# Altium project PCB_Project5.PrjPCB
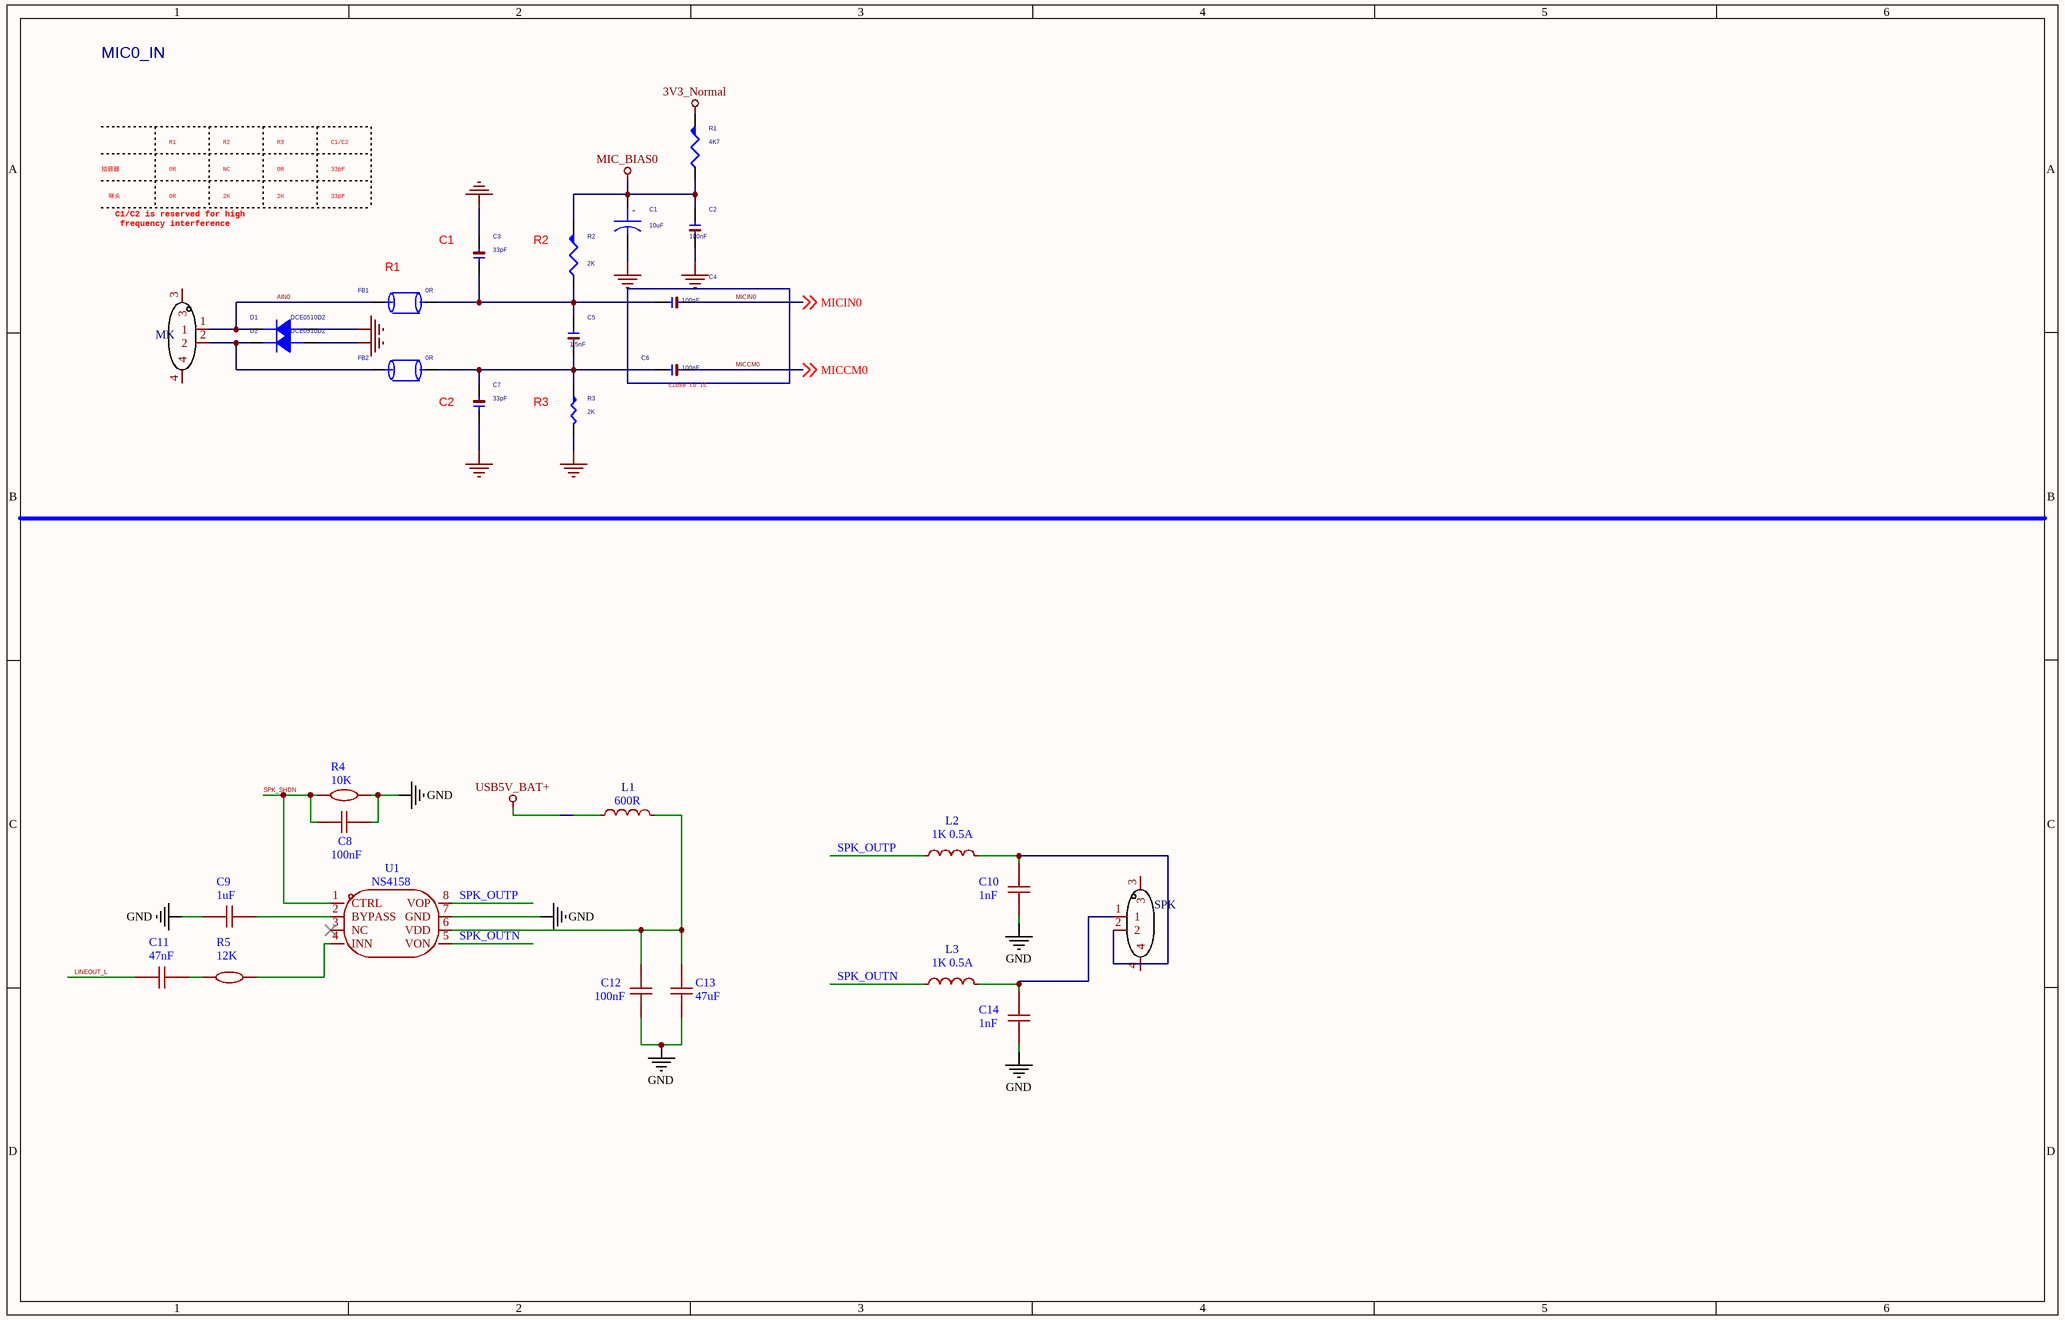
[diagram p0: AUDIO.SchDoc]
5 sheets, 256 parts. Net scope: global (net labels, ports and power ports of the same name join across sheets).
Board file: PCB1.PcbDoc
Sheets:
  AUDIO.SchDoc
  Bluetooth.SchDoc
  POWER.SchDoc
  QFN88_FLASH_UART.SchDoc
  USB_CHARGE.SchDoc

## Sheet AUDIO.SchDoc
size 386 x 246 mm

### Parts
C1  10uF  [C0603]
C2  100nF  [C0402]
C3  33pF  [C0402]
C4  100nF  [C0402]
C5  1.5nF  [C0402]
C6  100nF  [C0402]
C7  33pF  [C0402]
C8  100nF  [C0402]
C9  1uF  [C0805]
C10  1nF  [C0805]
C11  47nF  [C0805]
C12  100nF  [C0805]
C13  47uF  [C1206]
C14  1nF  [C0805]
CON1  MK  [CONN-SMD_2P-P1.25-LT]
CON2  SPK  [CONN-SMD_2.0-2PLT]
D1  DCE0510D2  [D0402_0.55x0.6]
D2  DCE0510D2  [D0402_0.55x0.6]
FB1  0R  [R0402]
FB2  0R  [R0402]
L1  600R  [L1206]
L2  1K 0.5A  [L0805]
L3  1K 0.5A  [L0805]
R1  4K7  [R0402]
R2  2K  [R0402]
R3  2K  [R0402]
R4  10K  [R0402]
R5  12K  [R0402]
U1  NS4158  [SOIC-8_L4.9-W3.9-P1.27-LS6.0-BL]

### Nets
3V3_Normal: R1.1
GND: C1.2 C2.2 C3.1 C7.2 C8.2 C9.1 C10.1 C12.1 C13.1 C14.1 D1.1(A) D2.1(A) R3.2 R4.2 U1.7(GND)  [project net DGND]
MIC_BIAS0: C1.1 C2.1 R1.2 R2.1
USB5V_BAT+: L1.1
AIN0: CON1.1 D1.2(K) FB1.1
LINEOUT_L: C11.1
MICCM0: C6.2 ; off-sheet MICCM0
MICIN0: C4.2 ; off-sheet MICIN0
SPK_OUTN: L3.1 U1.5(VON)
SPK_OUTP: L2.1 U1.8(VOP)
SPK_SHDN: C8.1 R4.1 U1.1(CTRL)
NetC3_2: C3.2 C4.1 C5.1 FB1.2 R2.2
NetC5_2: C5.2 C6.1 C7.1 FB2.2 R3.1
NetC9_2: C9.2 U1.2(BYPASS)
NetC10_2: C10.2 CON2.2 L2.2
NetC11_2: C11.2 R5.1
NetC12_2: C12.2 C13.2 L1.2 U1.6(VDD)
NetC14_2: C14.2 CON2.1 L3.2
NetCON1_2: CON1.2 D2.2(K) FB2.1
NetR5_2: R5.2 U1.4(INN)

Not connected (* = marked no-connect by the designer): CON1 3 4; CON2 3 4; U1 3(NC)*

### Notes on the sheet
- MIC0_IN
- 拾音器
- 0R
- R1
- NC
- R2
- R3
- 33pF
- C1/C2
- 咪头
- C1/C2 is reserved for high
  frequency interference
- 2K
- (near C3) C1
- (near R2) R2
- (near FB1) R1
- (near C6) close to IC
- C2
- (near R3) R3
- (in symbol CAP POL) +

### Library data of the parts
C1 = CAP POL
C2 C4-C6 = C0805_10uF: Class: DISCRETE
C3 C7 = C0402: Class: DISCRETE
C8-C12 C14 = CAP_0805: Symbol: CapAcitance; Convert to PCB: yes; Device: CAP_0805; Add into BOM: yes; Supplier Footprint: 0805
  C8 C12: Value: 100nF
  C9: Value: 1uF
  C10 C14: Value: 1nF
  C11: Value: 47nF
C13 = CAP_1206: Symbol: CapAcitance; Convert to PCB: yes; Device: CAP_1206; Add into BOM: yes; Supplier Footprint: 1206; Value: 47uF
CON1 CON2 = HC-1.25-2PLT: Add into BOM: yes; Pins Structure: 1x2P; Pitch: 1.25mm; Number of PINs Per Row: 2; Current Rating (Max): 2A; Symbol: HC-1.25-2PLT; Device: HC-1.25-2PLT; Supplier Part: C2845388; Manufacturer Part: HC-1.25-2PLT; Supplier Footprint: SMD,P=1.25mm; JLCPCB Part Class: Extended Part; Datasheet: https://atta.szlcsc.com/upload/public/pdf/source/20230707/8E5913B5A3195C18F5EE12EA4CB86B82.pdf; Supplier: LCSC; Convert to PCB: yes; Reference Series: -; Number of Pins: 2P; Number of Rows: 1; Row Spacing: -
D1 D2 = DIODE_Dup1
FB1 FB2 = BEAD: BEAD/0402/120ohm/200MA; Part_Type: 0402贴片磁珠; Part_Number: 49223; CLASS: DISCRETE; Fanvil_Spec: 0402-600Ω&100M/100mA/FBMA-11-100505-601T; C5_Val: 120; C4_Unit: R; C3_Pkg: 0402; C1_Manu: SMT; Fanvil_Type: 磁珠; Fanvil_ID: INT.1013; C2_Type: BEAD
L1 = CBW321609U601T: Add into BOM: yes; Current Rating: 2A; Circuits: 1; Symbol: CBW321609U601T; Device: CBW321609U601T; Supplier: LCSC; Manufacturer Part: 600R; Supplier Part: C73732; Supplier Footprint: 1206; Datasheet: https://atta.szlcsc.com/upload/public/pdf/source/20190129/C361676_507080CDC8DBC2B0B7C2139C1873642D.pdf; Convert to PCB: yes
L2 L3 = SBK201209T-102Y-N: Add into BOM: yes; Current Rating: 200mA; Circuits: 1; Symbol: SBK201209T-102Y-N; Device: SBK201209T-102Y-N; Supplier Part: C142036; Supplier Footprint: 0805; Datasheet: https://atta.szlcsc.com/upload/public/pdf/source/20181119/C285644_F4950E68CEB7BD9E18B05382B5272067.pdf; Supplier: LCSC; Convert to PCB: yes
  L2: Manufacturer Part: SBK201209T-102Y-N
  L3: Manufacturer Part: 1K 0.5A
R1 R2 = R-PIN-Mark
R3 = R0402: Class: DISCRETE
R4 = Res_0805: Convert to PCB: yes; Device: Res_0805; Add into BOM: yes; Supplier Footprint: 0805; Value: 10K
R5 = Res_0805: Convert to PCB: yes; Value: 30K; Device: Res_0805; Add into BOM: yes; Supplier Footprint: 0805
U1 = NS4158: Add into BOM: yes; Symbol: NS4158; Device: NS4158; LCSC Part Name: NS4158; Supplier Part: C2890042; Manufacturer Part: NS4158; Supplier Footprint: SOIC-8; Datasheet: https://atta.szlcsc.com/upload/public/pdf/source/20210826/9C0306C24076E9EB95F6FF2952664B70.pdf; Supplier: LCSC; Convert to PCB: yes

## Sheet Bluetooth.SchDoc
size 386 x 246 mm
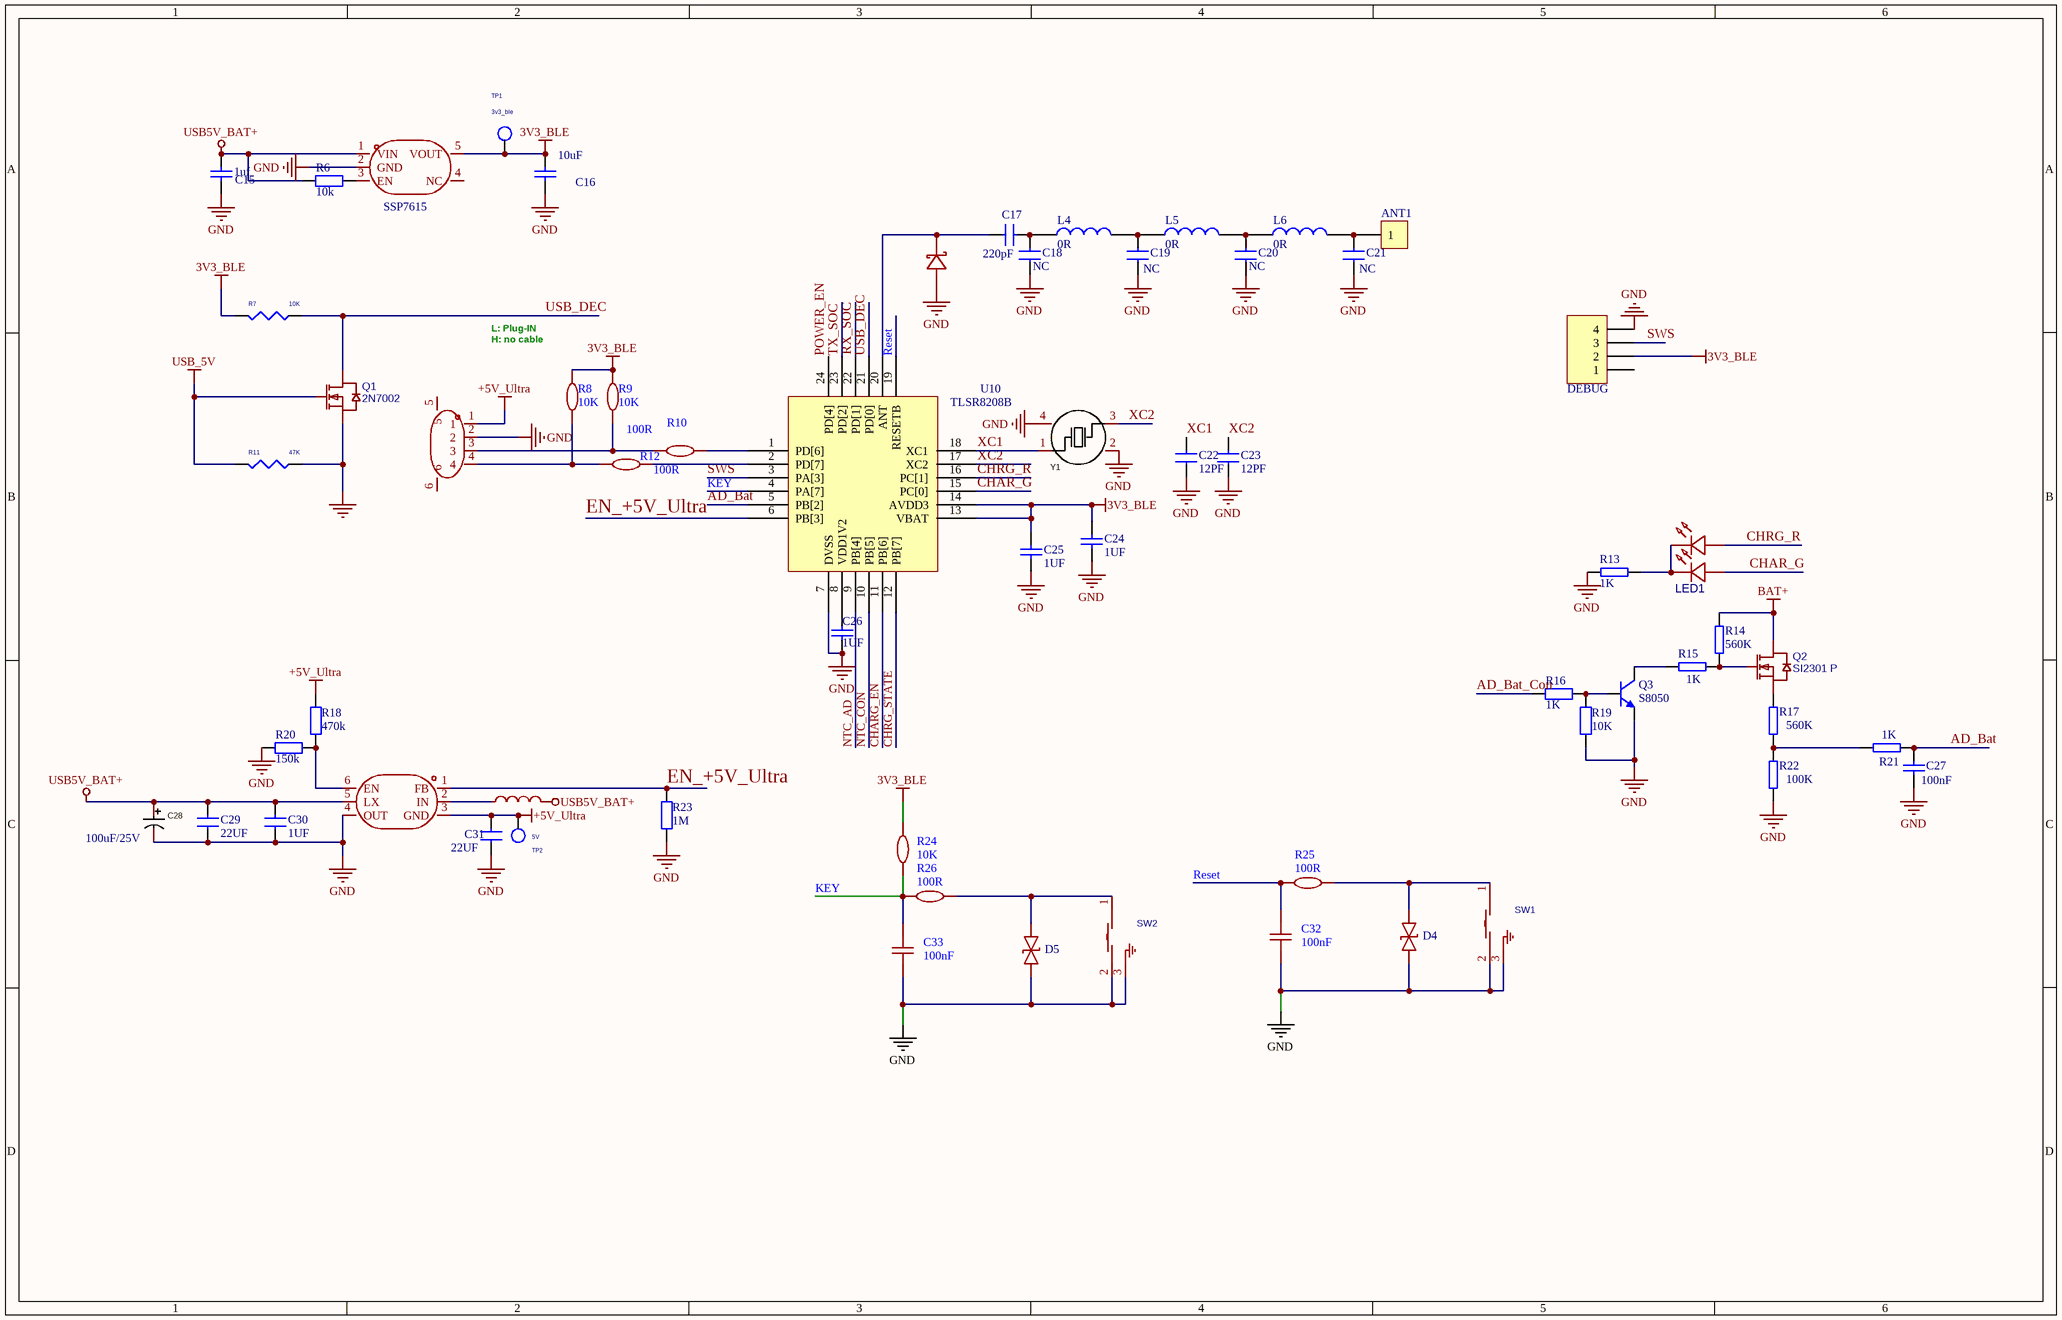
[diagram p1: Bluetooth.SchDoc]

### Parts
ANT1  (no value)  [tp]
C15  1uf  [0603_C]
C16  10uF  [0603_C]
C17  220pF  [0402_c]
C18  NC  [0402_C]
C19  NC  [0402_C]
C20  NC  [0402_C]
C21  NC  [0402_C]
C22  12PF  [0603_c]
C23  12PF  [0603_c]
C24  1UF  [0603_c]
C25  1UF  [0603_c]
C26  1UF  [0603_c]
C27  100nF  [c0402]
C28  100uF/25V  [SMD 6.3*5.4 电解]
C29  22UF  [0805_c]
C30  1UF  [0402_c]
C31  22UF  [0805_c]
C32  100nF  [c0402]
C33  100nF  [c0402]
CON4  Ultra  [CONN-SMD_4P-P1.25_LT]  (value not drawn)
D3  SE6V3LHN102T 6.3v单向  [0402-D]  (value not drawn)
D4  LESD5Z5.0CT1G  [SOD-523_L1.2-W0.8-LS1.6-BI]  (value not drawn)
D5  LESD5Z5.0CT1G  [SOD-523_L1.2-W0.8-LS1.6-BI]  (value not drawn)
L4  0R  [0402_R]
L5  0R  [0402_R]
L6  0R  [0402_R]
L7  SLW3012P1R5MST SMD3.0*3.0  [IND-SMD_L3.0-W3.0]  (value not drawn)
LED1  *  [LED-SMD_4P-L3.2-W1.6-TL_XL-3216SURUGC]  (value not drawn)
P1  DEBUG  [SIP4-2.54]
Q1  2N7002  [SOT-23]
Q2  SI2301 P  [SOT-23]
Q3  S8050  [SOT-23(SOT-23-3)]
R6  10k  [R0402]
R7  10K  [R0402]
R8  10K  [R0402]
R9  10K  [R0402]
R10  100R  [R0402]
R11  47K  [R0402]
R12  100R  [R0402]
R13  1K  [0603_R]
R14  560K  [R0402]
R15  1K  [R0402]
R16  1K  [R0402]
R17  560K  [R0402]
R18  470k  [0402_r]
R19  10K  [R0402]
R20  150k  [0402_r]
R21  1K  [R0402]
R22  100K  [R0402]
R23  1M  [0402_r]
R24  10K  [R0402]
R25  100R  [R0402]
R26  100R  [R0402]
SW1  Reset  [SMD-KEY-3]  (value not drawn)
SW2  OnOff  [SMD-KEY-3]  (value not drawn)
TP1  3v3_ble  [TP]
TP2  5V  [TP]
U2  SSP7615  [SOT-23-5]
U3  SY7069ADC  [SOT-23-6]  (value not drawn)
U10  TLSR8208B  [QFN-24-EP(4*4)]
Y1  24MHz +-20PPM  [CRYSTAL-SMD_4P-L3.2-W2.5]  (value not drawn)

### Nets
3V3_BLE: C16.2 C24.1 C25.1 P1.2 R7.1 R8.1 R9.1 R24.2 TP1.1(TP) U2.5(VOUT) U10.13(VBAT) U10.14(AVDD3)
+5V_Ultra: C31.2 CON4.1 R18.2 TP2.1(TP) U3.3(GND)
BAT+: Q2.2(D) R14.1
GND: C15.1 C16.1 C18.1 C19.1 C20.1 C21.1 C22.1 C23.1 C24.2 C25.2 C26.1 C27.1 C28.2 C29.1 C30.1 C31.1 C32.1 C33.1 CON4.2 D3.2(A) D4.1 D5.1 P1.4 Q1.2(S) Q3.2(E) R11.2 R13.1 R19.1 R20.2 R22.2 R23.1 SW1.2 SW1.3 SW2.2 SW2.3 U2.2(GND) U3.4(OUT) U10.7(DVSS) Y1.2(GND) Y1.4(GND)  [project net DGND]
USB5V_BAT+: C15.2 C28.1 C29.2 C30.2 L7.2 R6.1 U2.1(VIN) U3.5(LX)
USB_5V: Q1.1(G) R11.1
AD_Bat: C27.2 R21.1 U10.5(PB[2])
AD_Bat_Con: R16.2
CHAR_G: LED1.3(A) U10.15(PC[0])
CHARG_EN: U10.11(PB[6])
CHRG_R: LED1.1(A) U10.16(PC[1])
CHRG_STATE: U10.12(PB[7])
EN_+5V_Ultra: R23.2 U3.1(FB) U10.6(PB[3])
KEY: C33.2 R24.1 R26.2 U10.4(PA[7])
NTC_AD: U10.9(PB[4])
NTC_CON: U10.10(PB[5])
POWER_EN: U10.24(PD[4])
Reset: C32.2 R25.2 U10.19(RESETB)
RX_SOC: U10.22(PD[1])
SWS: P1.3 U10.3(PA[3])
TX_SOC: U10.23(PD[2])
USB_DEC: Q1.3(D) R7.2 U10.21(PD[0])
XC1: C22.2 U10.18(XC1) Y1.1(OSC1)
XC2: C23.2 U10.17(XC2) Y1.3(OSC2)
NetANT1_1: ANT1.1 C21.2 L6.2
NetC17_1: C17.1 D3.1(C) U10.20(ANT)
NetC17_2: C17.2 C18.2 L4.1
NetC19_2: C19.2 L4.2 L5.1
NetC20_2: C20.2 L5.2 L6.1
NetC26_2: C26.2 U10.8(VDD1V2)
NetCON4_3: CON4.3 R9.2 R10.2
NetCON4_4: CON4.4 R8.2 R12.2
NetD4_2: D4.2 R25.1 SW1.1
NetD5_2: D5.2 R26.1 SW2.1
NetL7_1: L7.1 U3.2(IN)
NetLED1_2: LED1.2(K) LED1.4(K) R13.2
NetQ2_1: Q2.1(G) R14.2 R15.1
NetQ2_3: Q2.3(S) R17.1
NetQ3_1: Q3.1(B) R16.1 R19.2
NetQ3_3: Q3.3(C) R15.2
NetR6_2: R6.2 U2.3(EN)
NetR10_1: R10.1 U10.1(PD[6])
NetR12_1: R12.1 U10.2(PD[7])
NetR17_2: R17.2 R21.2 R22.1
NetR18_1: R18.1 R20.1 U3.6(EN)

Not connected (* = marked no-connect by the designer): CON4 5 6; P1 1; U2 4(NC)

### Notes on the sheet
- L: Plug-IN
  H: no cable

### Library data of the parts
ANT1 = CON1: Connector
C15 = Cap1: 无极电容
C16 = Cap: Capacitor; Value: 10nF; Published: 8-Jun-2000; Revision: July-2002: Re-released for DXP Platform.; Publisher: Altium Limited
C17-C23 C29-C31 = CAP: Capacitor
C24-C27 = CAP
C28 = RVT1A221M0605_C72494: Symbol: RVT1A221M0605-C72494; Value: 220uF; Add into BOM: yes; Rated Voltage: 10V; Ripple Current: 90mA@120Hz; L: 5.4mm; Device: RVT1A221M0605_C72494; Supplier: LCSC; Manufacturer Part: RVT1A221M0605; Supplier Part: C72494; JLCPCB Part Class: Extended Part; Supplier Footprint: SMD,D6.3xL5.4mm; Datasheet: https://atta.szlcsc.com/upload/public/pdf/source/20170325/1490427950282.pdf; Convert to PCB: yes; Equivalent Series Resistance(ESR): -
C32 C33 = CAP_0603: Symbol: CapAcitance; Convert to PCB: yes; Device: CAP_0603; Add into BOM: yes; Supplier Footprint: 0603; Value: 100nF
CON4 = HC-1.25-4PLT: Symbol: HC-1.25-4PLT
D3 = TPNSR05F20NXT5G: Symbol: TPNSR05F20NXT5G
D4 D5 = LESD5Z5.0CT1G: Add into BOM: yes; Reverse Stand-Off Voltage (Vrwm): 5V; Maximum Clamping Voltage: 18.6V; Peak Pulse Current (Ipp)@10/1000us: 9.4A; Breakdown Voltage: 5.6V; Type: ESD; Symbol: LESD5Z5.0CT1G; Device: LESD5Z5.0CT1G; Supplier: LCSC; Manufacturer Part: LESD5Z5.0CT1G; Supplier Part: C136167; Supplier Footprint: SOD-523; Datasheet: https://atta.szlcsc.com/upload/public/pdf/source/20171026/C136167_15089841930291059137.pdf; Convert to PCB: yes
L4-L6 = INDUCTOR
L7 = SLW3012P1R5MST: Symbol: SLW3012P1R5MST
LED1 = TJ-S2012SW8TCGLC2R2G-A5: Symbol: TJ-S2012SW8TCGLC2R2G-A5
P1 = Header 4: Header, 4-Pin; LatestRevisionDate: 17-Jul-2002; LatestRevisionNote: Re-released for DXP Platform.; Publisher: Altium Limited
Q1 Q2 = JMTL3400A: Contributor: LCSC; BOM_Supplier: LCSC; BOM_Supplier Part: C2890442; BOM_Manufacturer Part: JMTL3400A; BOM_JLCPCB Part Class: Extended Part; spicePre: Q; spiceSymbolName: JMTL3400A
Q3 = NPN_sot23: NPN三极管
R6 R16 R18-R20 R23 = Res2: Resistor; Value: 120R; Published: 8-Jun-2000; LatestRevisionDate: 17-Jul-2002; LatestRevisionNote: Re-released for DXP Platform.; PackageReference: AXIAL-0.4; Publisher: Altium Limited
R7 R11 = R_Dup2
R8 R9 = Res_0603: Convert to PCB: yes; Value: 100R; Device: Res_0603; Add into BOM: yes; Supplier Footprint: 0603
R10 R12 R24-R26 = Res_0603: Convert to PCB: yes; Device: Res_0603; Add into BOM: yes; Supplier Footprint: 0603
  R10 R12 R25 R26: Value: 100R
  R24: Value: 10K
R13-R15 R17 R21 R22 = RES
SW1 SW2 = K2-1109SE-I4SW-04: Symbol: K2-1109SE-I4SW-04
TP1 TP2 = T POINT R
U2 = SSP7615-33M5R: Symbol: SSP7615-33M5R
Y1 = TAXM13.56M4RLBCCT2T: Name: 13.56MHz; Add into BOM: yes; Value: 13.56MHz; External load capacitor: 20pF; Device: TAXM13.56M4RLBCCT2T; Supplier Part: C164051; Manufacturer Part: TAXM13.56M4RLBCCT2T; Supplier Footprint: SMD3225-4P; JLCPCB Part Class: Extended Part; Datasheet: https://atta.szlcsc.com/upload/public/pdf/source/20171225/C164051_15141924799131203407.pdf; Supplier: LCSC; Convert to PCB: yes
U3 = SY7069ADC: Symbol: SY7069ADC

## Sheet POWER.SchDoc
size 513 x 304 mm
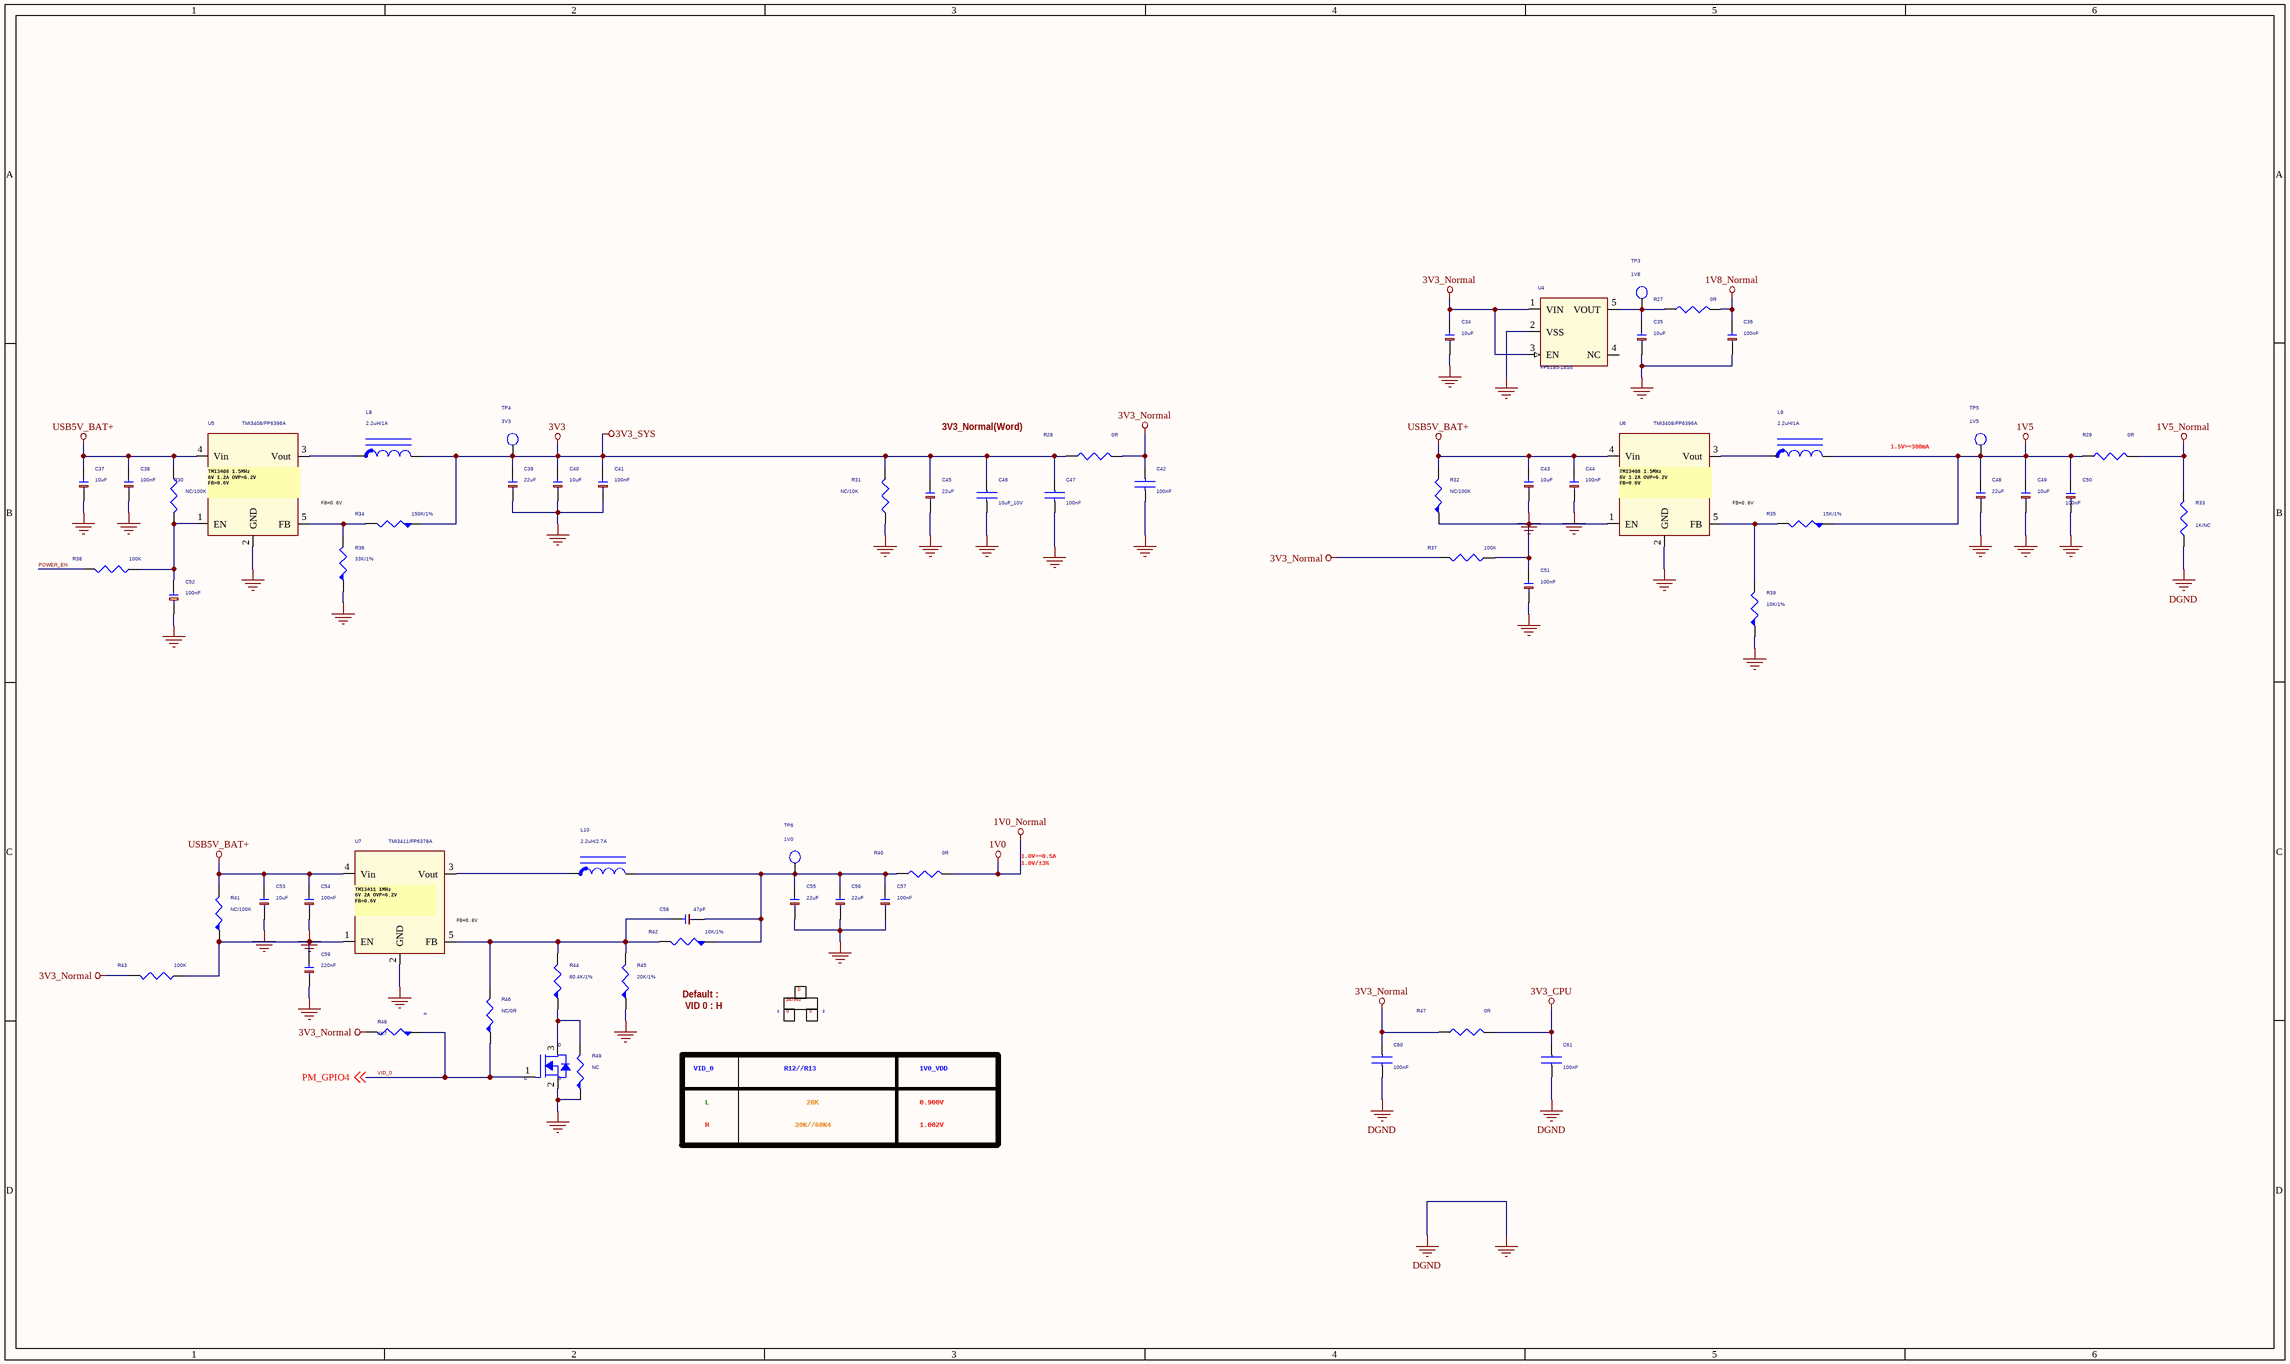
[diagram p2: POWER.SchDoc]

### Parts
C34  10uF  [C0402]
C35  10uF  [C0402]
C36  100nF  [C0402]
C37  10uF  [C0402]
C38  100nF  [C0402]
C39  22uF  [C0402]
C40  10uF  [C0402]
C41  100nF  [C0402]
C42  100nF  [C0402]
C43  10uF  [C0402]
C44  100nF  [C0402]
C45  22uF  [C0402]
C46  10uF_10V  [C0603]
C47  100nF  [C0402]
C48  22uF  [C0402]
C49  10uF  [C0402]
C50  100nF  [C0402]
C51  100nF  [C0402]
C52  100nF  [C0402]
C53  10uF  [C0402]
C54  100nF  [C0402]
C55  22uF  [C0402]
C56  22uF  [C0402]
C57  100nF  [C0402]
C58  47pF  [C0402]
C59  220nF  [C0402]
C60  100nF  [C0402]
C61  100nF  [C0402]
L8  2.2uH/1A  [SWPA3015S]
L9  2.2uH/1A  [SWPA3015S]
L10  2.2uH/2.7A  [L-MLPS-4018]
Q4  2N7002  [SOT-23]  (value not drawn)
R27  0R  [R0402]
R28  0R  [R1210]
R29  0R  [R1210]
R30  NC/100K  [R0402]
R31  NC/10K  [R0402]
R32  NC/100K  [R0402]
R33  1K/NC  [R0402]
R34  150K/1%  [R0402]
R35  15K/1%  [R0402]
R36  33K/1%  [R0402]
R37  100K  [R0402]
R38  100K  [R0402]
R39  10K/1%  [R0402]
R40  0R  [R1210]
R41  NC/100K  [R0402]
R42  10K/1%  [R0402]
R43  100K  [R0402]
R44  60.4K/1%  [R0402]
R45  20K/1%  [R0402]
R46  NC/0R  [R0402]
R47  0R  [R1210]
R48  4K7  [R0402]
R49  NC  [R0402]
TP3  1V8  [TP]
TP4  3V3  [TP]
TP5  1V5  [TP]
TP6  1V0  [TP]
U4  FP6185-18S5  [SOT23-5P]
U5  TMI3408/FP6396A  [SOT-23-5]
U6  TMI3408/FP6396A  [SOT-23-5]
U7  TMI3411/FP6378A  [SOT-23-5]

### Nets
1V0: R40.2  [also labelled 1V0_Normal]
1V5: C48.2 C49.2 C50.1 L9.2 R29.1 R35.1 TP5.1(TP)
1V5_Normal: R29.2 R33.1
1V8_Normal: C36.2 R27.2
3V3: C39.2 C40.2 C41.2 C45.2 C46.1 C47.1 L8.2 R28.1 R31.1 R34.1 TP4.1(TP)  [also labelled 3V3_SYS]
3V3_CPU: C61.1 R47.2
3V3_Normal: C34.2 C42.1 C60.1 R28.2 R37.2 R43.1 R47.1 R48.2 U4.1(VIN) U4.3(EN)
DGND: C34.1 C35.1 C36.1 C37.1 C38.1 C39.1 C40.1 C41.1 C42.2 C43.1 C44.1 C45.1 C46.2 C47.2 C48.1 C49.1 C50.2 C51.1 C52.1 C53.1 C54.1 C55.1 C56.1 C57.1 C59.1 C60.2 C61.2 Q4.2(SOURCE) R31.2 R33.2 R36.1 R39.1 R45.1 R49.1 U4.2(VSS) U5.2(GND) U6.2(GND) U7.2(GND)  [also labelled GND]
USB5V_BAT+: C37.2 C38.2 C43.2 C44.2 C53.2 C54.2 R30.2 R32.2 R41.2 U5.4(Vin) U6.4(Vin) U7.4(Vin)
PM_GPIO4: Q4.1(GATE) R46.1 R48.1 ; off-sheet PM_GPIO4  [also labelled VID_0]
POWER_EN: R38.2
NetC35_2: C35.2 R27.1 TP3.1(TP) U4.5(VOUT)
NetC51_2: C51.2 R32.1 R37.1 U6.1(EN)
NetC52_2: C52.2 R30.1 R38.1 U5.1(EN)
NetC55_2: C55.2 C56.2 C57.2 C58.1 L10.2 R40.1 R42.1 TP6.1(TP)
NetC58_2: C58.2 R42.2 R44.2 R45.2 R46.2 U7.5(FB)
NetC59_2: C59.2 R41.1 R43.2 U7.1(EN)
NetL8_1: L8.1 U5.3(Vout)
NetL9_1: L9.1 U6.3(Vout)
NetL10_1: L10.1 U7.3(Vout)
NetQ4_3: Q4.3(DRAIN) R44.1 R49.2
NetR34_2: R34.2 R36.2 U5.5(FB)
NetR35_2: R35.2 R39.2 U6.5(FB)

Not connected (* = marked no-connect by the designer): U4 4(NC)

### Notes on the sheet
- 3V3_Normal(Word)
- 1.5V>=300mA
- (near U5) FB=0.6V
- (near U6) FB=0.6V
- 1.0V>=0.5A
  1.0V/±3%
- (near U7) FB=0.6V
- (near R48) 3
- Default :
  VID 0 : H
- 1
- G
- 2N7002
- D
- S
- 2
- VID_0
- R12//R13
- 1V0_VDD
- L
- H
- 20K//60K4
- 20K
- 1.002V
- 0.900V
- (in symbol AO3400_SOT23) D; G; S
- (in symbol LDO,iD9306-AD,300mA_3) TMI3408 1.5MHz / 6V 1.2A OVP=6.2V / FB=0.6V /
- (in symbol LDO,iD9306-AD,300mA_4) TMI3411 1MHz / 6V 2A OVP=6.2V / FB=0.6V /

### Library data of the parts
C34-C41 C43-C45 C48 C49 C51-C59 = C0402/100nF/10V/X7R: [ 100nF(0.1uF),10V,X7R ](0402); Part Name: 0402B104K100C; Brand: Walsin地穝; Class: Capacitor; Creator: Alan.Liu#6135/0920796617
C42 C46 C47 C60 C61 = CAP NP2
C50 = C0805_10uF: Class: DISCRETE
L8-L10 = CHOKE_4.7uH/4.1A-L8.0W8.0H4.0: [ 4.7uH/4100mA ]; Inductance:4.7uH+-30%;Rated Current:4100mA;Self-resonant Frequency:30MHz;DC.Resistance:0.018R+-30%;; Part Name: NR8040T4R7N; Class: Choke; Brand: TAIYO YUDENび锭护筿; Creator: Alan.Liu#6135/0920796617
Q4 = AO3400_SOT23: BOM: N-Channel EMFET 2N7002 SOT23 <FAIRCHILD>; COST(NT$): 4.69
R27 = R_Dup1
R28-R31 R33 R37 R38 R40 R43 R47 = R_Dup2
R32 R34-R36 R39 R41 R42 R44-R46 R48 R49 = R-PIN-Mark
TP3-TP6 = T POINT R
U4 = ADP1610_7
U5 U6 = LDO,iD9306-AD,300mA_3: iD9306-AD; Part Number: 300035100G; Specification: SOT23,1.8V,ROHS
U7 = LDO,iD9306-AD,300mA_4: iD9306-AD; Part Number: 300035100G; Specification: SOT23,1.8V,ROHS

## Sheet QFN88_FLASH_UART.SchDoc
size 635 x 457 mm
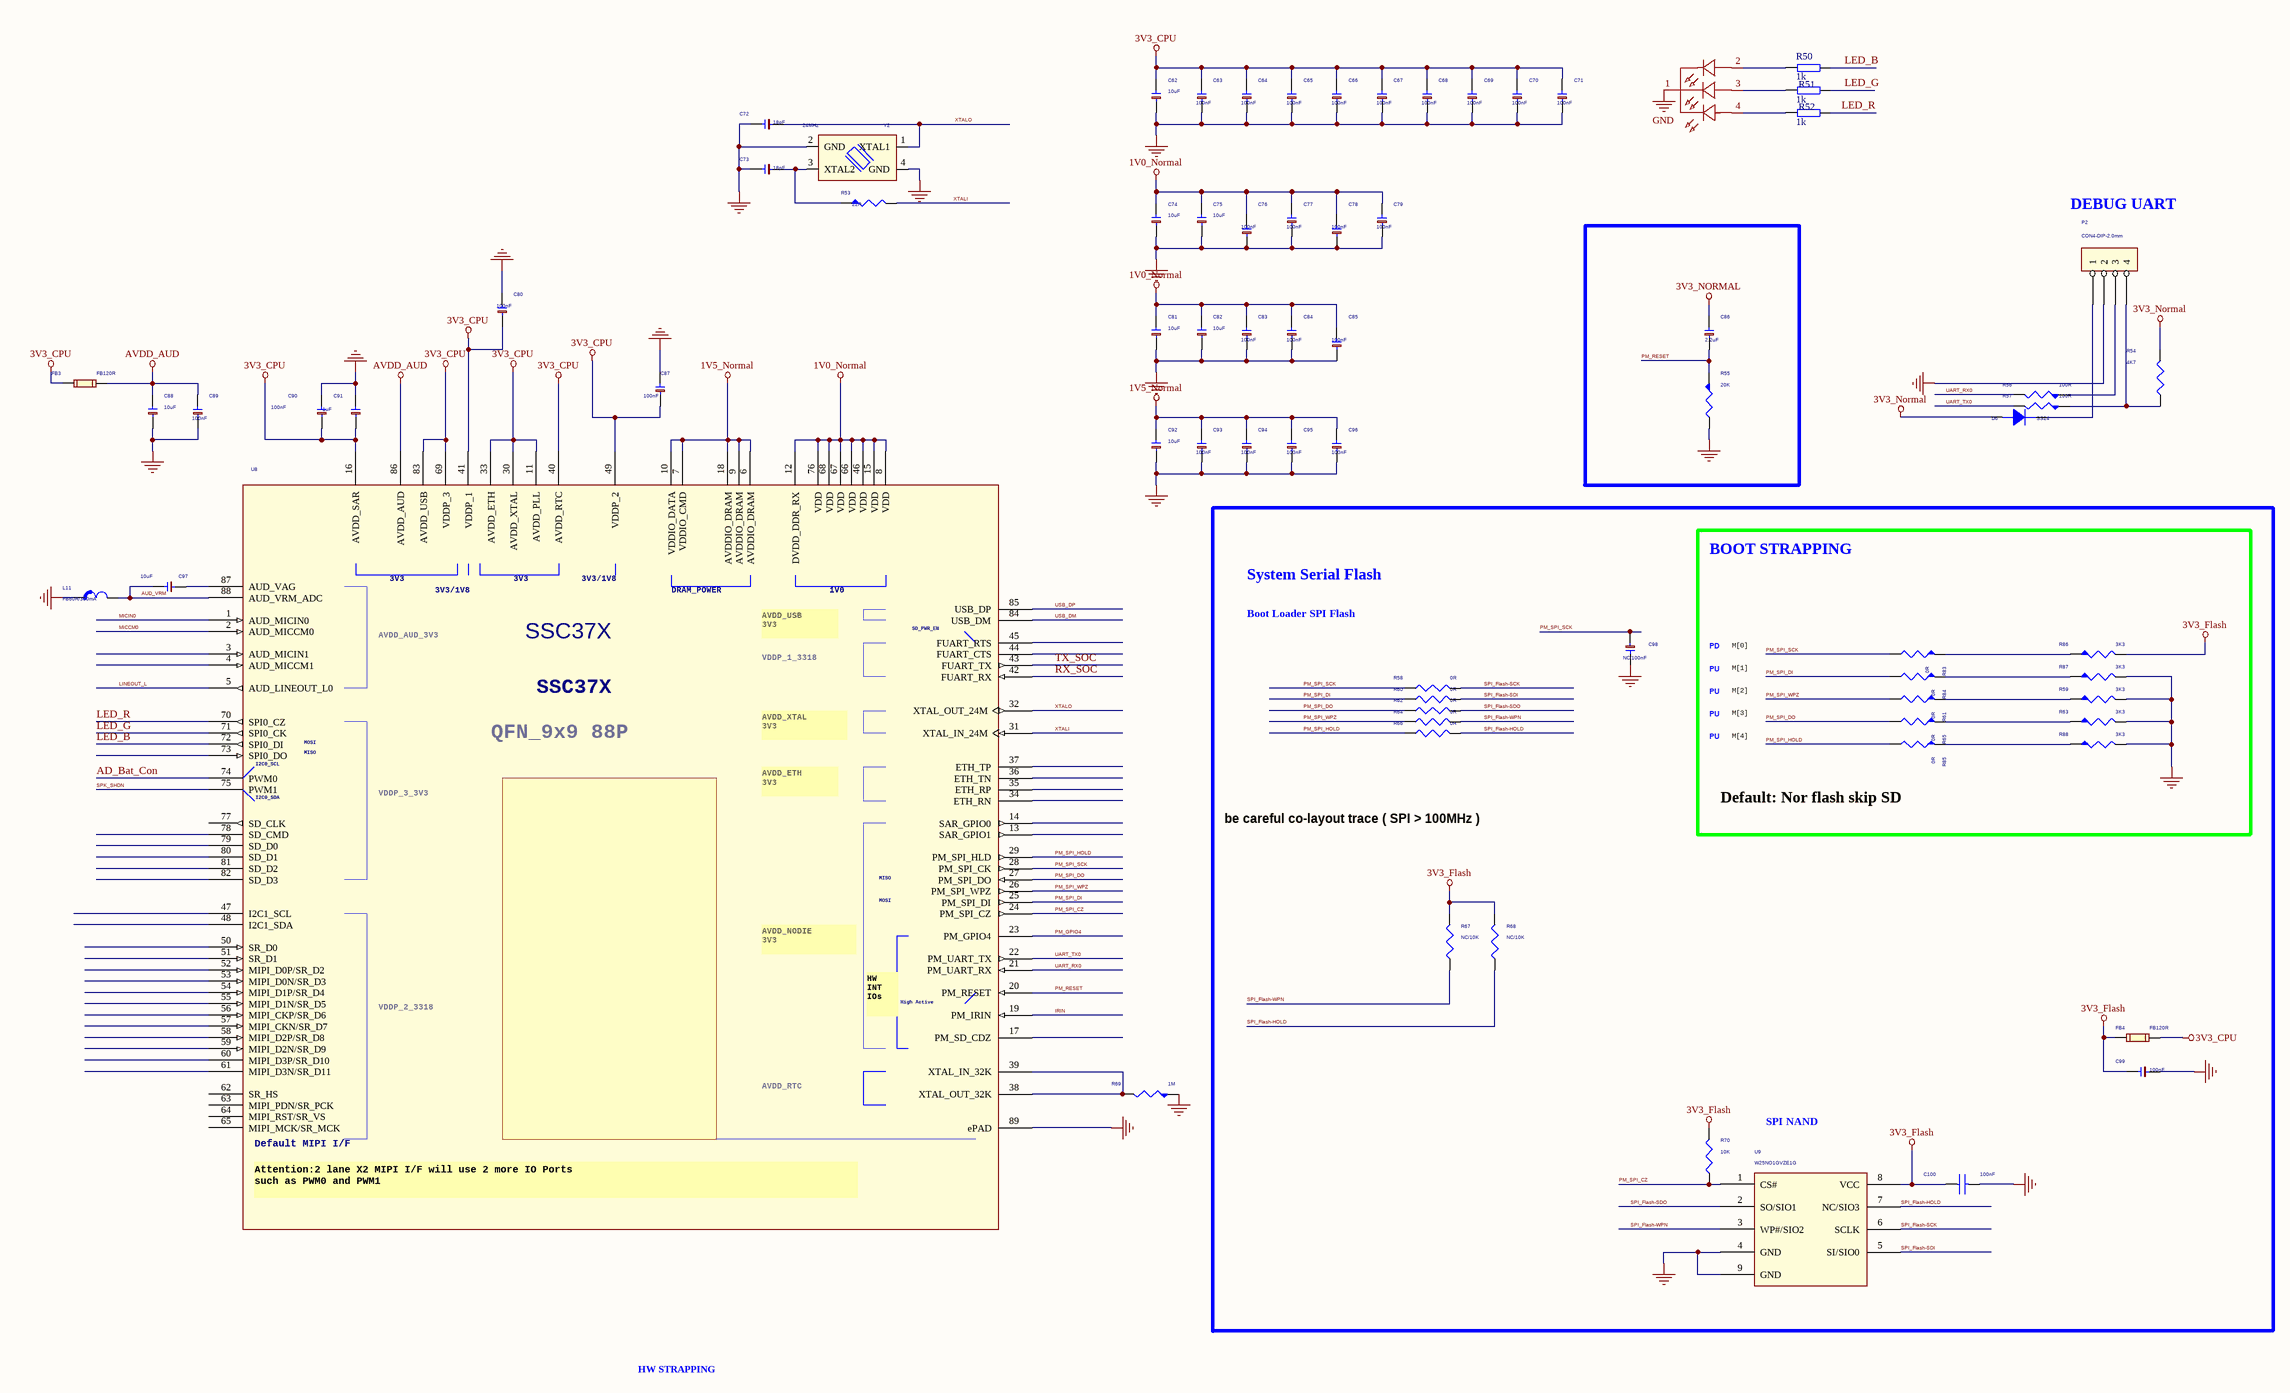
[diagram p3: QFN88_FLASH_UART.SchDoc]

### Parts
C62  10uF  [C0603]
C63  100nF  [C0402]
C64  100nF  [C0402]
C65  100nF  [C0402]
C66  100nF  [C0402]
C67  100nF  [C0402]
C68  100nF  [C0402]
C69  100nF  [C0402]
C70  100nF  [C0402]
C71  100nF  [C0402]
C72  18pF  [C0402]
C73  18pF  [C0402]
C74  10uF  [C0603]
C75  10uF  [C0603]
C76  100nF  [C0402]
C77  100nF  [C0402]
C78  100nF  [C0402]
C79  100nF  [C0402]
C80  100nF  [C0402]
C81  10uF  [C0603]
C82  10uF  [C0603]
C83  100nF  [C0402]
C84  100nF  [C0402]
C85  100nF  [C0402]
C86  2.2uF  [C0805]
C87  100nF  [C0402]
C88  10uF  [C0603]
C89  100nF  [C0402]
C90  100nF  [C0402]
C91  1uF  [C0402]
C92  10uF  [C0603]
C93  100nF  [C0402]
C94  100nF  [C0402]
C95  100nF  [C0402]
C96  100nF  [C0402]
C97  10uF  [C0402]
C98  NC/100nF  [C0402]
C99  100nF  [C0402]
C100  100nF  [C0402]
D6  SS24  [DO-214AC]
FB3  FB120R  [0603_R]
FB4  FB120R  [R0603]
L11  FB60R/300mA  [L0603]
LED2  XL-A3528RGBC-BM  [LED-ARRAY-SMD_4P-L3.2-W2.8-LS3.5-BL_XL-A3528RGBC-BM]  (value not drawn)
P2  CON4-DIP-2.0mm  [SIP4 2.0]
R50  1k  [0603_R]
R51  1k  [0603_R]
R52  1k  [0603_R]
R53  22R  [R0402]
R54  4K7  [R0402]
R55  20K  [R0402]
R56  100R  [R0402]
R57  100R  [R0402]
R58  0R  [R0402]
R59  3K3  [R0402]
R60  0R  [R0402]
R61  0R  [R0402]
R62  0R  [R0402]
R63  3K3  [R0402]
R64  0R  [R0402]
R65  0R  [R0402]
R66  0R  [R0402]
R67  NC/10K  [R0402]
R68  NC/10K  [R0402]
R69  1M  [R0402]
R70  10K  [R0402]
R83  0R  [R0402]
R84  0R  [R0402]
R85  0R  [R0402]
R86  3K3  [R0402]
R87  3K3  [R0402]
R88  3K3  [R0402]
U8  SSC37X  [IC-88P-QFN9X9-P035]
U9  W25NO1GVZE1G  [SOP8-150+208]
Y2  24MHz  [CRYSTAL-SMD_4P-L3.2-W2.5-BL]

### Nets
1V0_Normal: C74.2 C75.2 C76.1 C77.1 C78.1 C79.1 C81.2 C82.2 C83.1 C84.1 C85.1 U8.8(VDD) U8.12(DVDD_DDR_RX) U8.15(VDD) U8.46(VDD) U8.66(VDD) U8.67(VDD) U8.68(VDD) U8.76(VDD)  [project net 1V0]
1V5_Normal: C92.2 C93.1 C94.1 C95.1 C96.1 U8.6(AVDDIO_DRAM) U8.7(VDDIO_CMD) U8.9(AVDDIO_DRAM) U8.10(VDDIO_DATA) U8.18(AVDDIO_DRAM)
3V3_CPU: C62.2 C63.1 C64.1 C65.1 C66.1 C67.1 C68.1 C69.1 C70.1 C71.1 C80.2 C87.2 C90.2 C91.2 FB3.1 FB4.2 U8.11(AVDD_PLL) U8.16(AVDD_SAR) U8.30(AVDD_XTAL) U8.33(AVDD_ETH) U8.40(AVDD_RTC) U8.41(VDDP_1) U8.49(VDDP_2) U8.69(VDDP_3) U8.83(AVDD_USB)
3V3_Flash: C99.1 C100.1 FB4.1 R67.1 R68.1 R70.1 R86.2 U9.8(VCC)
3V3_Normal: C86.1 D6.2(A) R54.1
AVDD_AUD: C88.2 C89.1 FB3.2 U8.86(AVDD_AUD)
GND: C62.1 C63.2 C64.2 C65.2 C66.2 C67.2 C68.2 C69.2 C70.2 C71.2 C72.1 C73.1 C74.1 C75.1 C76.2 C77.2 C78.2 C79.2 C80.1 C81.1 C82.1 C83.2 C84.2 C85.2 C87.1 C88.1 C89.2 C90.1 C91.1 C92.1 C93.2 C94.2 C95.2 C96.2 C98.1 C99.2 C100.2 L11.1 LED2.1 P2.2 R55.2 R59.2 R63.2 R69.1 R87.2 R88.2 U8.89(ePAD) U9.4(GND) U9.9(GND) Y2.2(GND) Y2.4(GND)  [project net DGND]
AD_Bat_Con: U8.74(PWM0)
AUD_VRM: C97.2 L11.2 U8.88(AUD_VRM_ADC)
IRIN: U8.19(PM_IRIN)
LED_B: R50.2 U8.72(SPI0_DI)
LED_G: R51.2 U8.71(SPI0_CK)
LED_R: R52.2 U8.70(SPI0_CZ)
LINEOUT_L: U8.5(AUD_LINEOUT_L0)
MICCM0: U8.2(AUD_MICCM0)
MICIN0: U8.1(AUD_MICIN0)
PM_GPIO4: U8.23(PM_GPIO4)
PM_RESET: C86.2 R55.1 U8.20(PM_RESET)
PM_SPI_CZ: R70.2 U8.24(PM_SPI_CZ) U9.1(CS#)
PM_SPI_DI: R60.1 R84.2 U8.25(PM_SPI_DI)
PM_SPI_DO: R62.1 R65.2 U8.27(PM_SPI_DO)
PM_SPI_HOLD: R66.1 R85.2 U8.29(PM_SPI_HLD)
PM_SPI_SCK: C98.2 R58.1 R83.2 U8.28(PM_SPI_CK)
PM_SPI_WPZ: R61.2 R64.1 U8.26(PM_SPI_WPZ)
RX_SOC: U8.42(FUART_RX)
SPI_Flash-HOLD: R66.2 R68.2 U9.7(NC/SIO3)
SPI_Flash-SCK: R58.2 U9.6(SCLK)
SPI_Flash-SDI: R60.2 U9.5(SI/SIO0)
SPI_Flash-SDO: R62.2 U9.2(SO/SIO1)
SPI_Flash-WPN: R64.2 R67.2 U9.3(WP#/SIO2)
SPK_SHDN: U8.75(PWM1)
TX_SOC: U8.43(FUART_TX)
UART_RX0: R56.2 U8.21(PM_UART_RX)
UART_TX0: R57.2 U8.22(PM_UART_TX)
USB_DM: U8.84(USB_DM)
USB_DP: U8.85(USB_DP)
XTALI: R53.2 U8.31(XTAL_IN_24M)
XTALO: C72.2 U8.32(XTAL_OUT_24M) Y2.1(XTAL1)
NetC73_2: C73.2 R53.1 Y2.3(XTAL2)
NetC97_1: C97.1 U8.87(AUD_VAG)
NetD6_1: D6.1(K) P2.1
NetLED2_2: LED2.2 R50.1
NetLED2_3: LED2.3 R51.1
NetLED2_4: LED2.4 R52.1
NetP2_3: P2.3 R56.1
NetP2_4: P2.4 R54.2 R57.1
NetR59_1: R59.1 R61.1
NetR63_1: R63.1 R65.1
NetR69_2: R69.2 U8.38(XTAL_OUT_32K) U8.39(XTAL_IN_32K)
NetR83_1: R83.1 R86.1
NetR84_1: R84.1 R87.1
NetR85_1: R85.1 R88.1

Not connected (* = marked no-connect by the designer): U8 3(AUD_MICIN1) 4(AUD_MICCM1) 13(SAR_GPIO1) 14(SAR_GPIO0) 17(PM_SD_CDZ) 34(ETH_RN) 35(ETH_RP) 36(ETH_TN) 37(ETH_TP) 44(FUART_CTS) 45(FUART_RTS) 47(I2C1_SCL) 48(I2C1_SDA) 50(SR_D0) 51(SR_D1) 52(MIPI_D0P/SR_D2) 53(MIPI_D0N/SR_D3) 54(MIPI_D1P/SR_D4) 55(MIPI_D1N/SR_D5) 56(MIPI_CKP/SR_D6) 57(MIPI_CKN/SR_D7) 58(MIPI_D2P/SR_D8) 59(MIPI_D2N/SR_D9) 60(MIPI_D3P/SR_D10) 61(MIPI_D3N/SR_D11) 62(SR_HS) 63(MIPI_PDN/SR_PCK) 64(MIPI_RST/SR_VS) 65(MIPI_MCK/SR_MCK) 73(SPI0_DO) 77(SD_CLK) 78(SD_CMD) 79(SD_D0) 80(SD_D1) 81(SD_D2) 82(SD_D3)

### Notes on the sheet
- DEBUG UART
- BOOT STRAPPING
- System Serial Flash
- Boot Loader SPI Flash
- PD
- PU
- M[1]
- M[0]
- M[2]
- M[3]
- M[4]
- Default: Nor flash skip SD
- be careful co-layout trace ( SPI > 100MHz )
- SPI NAND
- HW STRAPPING
- (in symbol QFN_88P_20_2) 3V3; 3V3/1V8; DRAM_POWER; 1V0; SD_PWR_EN; AVDD_USB / 3V3; AVDD_AUD_3V3; VDDP_1_3318; AVDD_XTAL / 3V3; MOSI; QFN_9x9 88P; MISO; I2C0_SCL; AVDD_ETH / 3V3; I2C0_SDA; VDDP_3_3V3; AVDD_NODIE / 3V3; High Active; VDDP_2_3318; HW / INT / IOs; Default MIPI I/F; Attention:2 lane X2 MIPI I/F will use 2 more IO Ports / such as PWM0 and PWM1

### Library data of the parts
C62 C74 C75 C81 C82 C88 C92 = C0402/100nF/10V/X7R: as C34 on sheet POWER; Creator: Alan.Liu#6135/0920796617
C63-C73 C76-C80 C83-C87 C89-C91 C93-C96 C98 C99 = C0805_10uF: Class: DISCRETE
C97 = C0402: Class: DISCRETE; BOM: CAP: 4.7uF, 0603
C100 = CAP NP2
D6 = DIODE
FB3 FB4 = SMD_BEAD_FB0603: Current: 2A
L11 = L0603: Class: DISCRETE
P2 = HEADER_1x4-2mm_1
R50-R52 = RES
R53 R55-R57 R59 R61 R63 R65 R69 R83-R88 = R-PIN-Mark
R54 R67 R68 R70 = R_Dup2
R58 R60 R62 R64 R66 = R_Dup1
U8 = QFN_88P_20_2
U9 = 24C08_3
Y2 = OSC-20MHz_HALF_4: Class: IC; BOM: DIP-OSC 20MHz  HALF <TXC>
LED2 = XL-A3528RGBC-BM: Symbol: XL-A3528RGBC-BM

## Sheet USB_CHARGE.SchDoc
size 386 x 233 mm
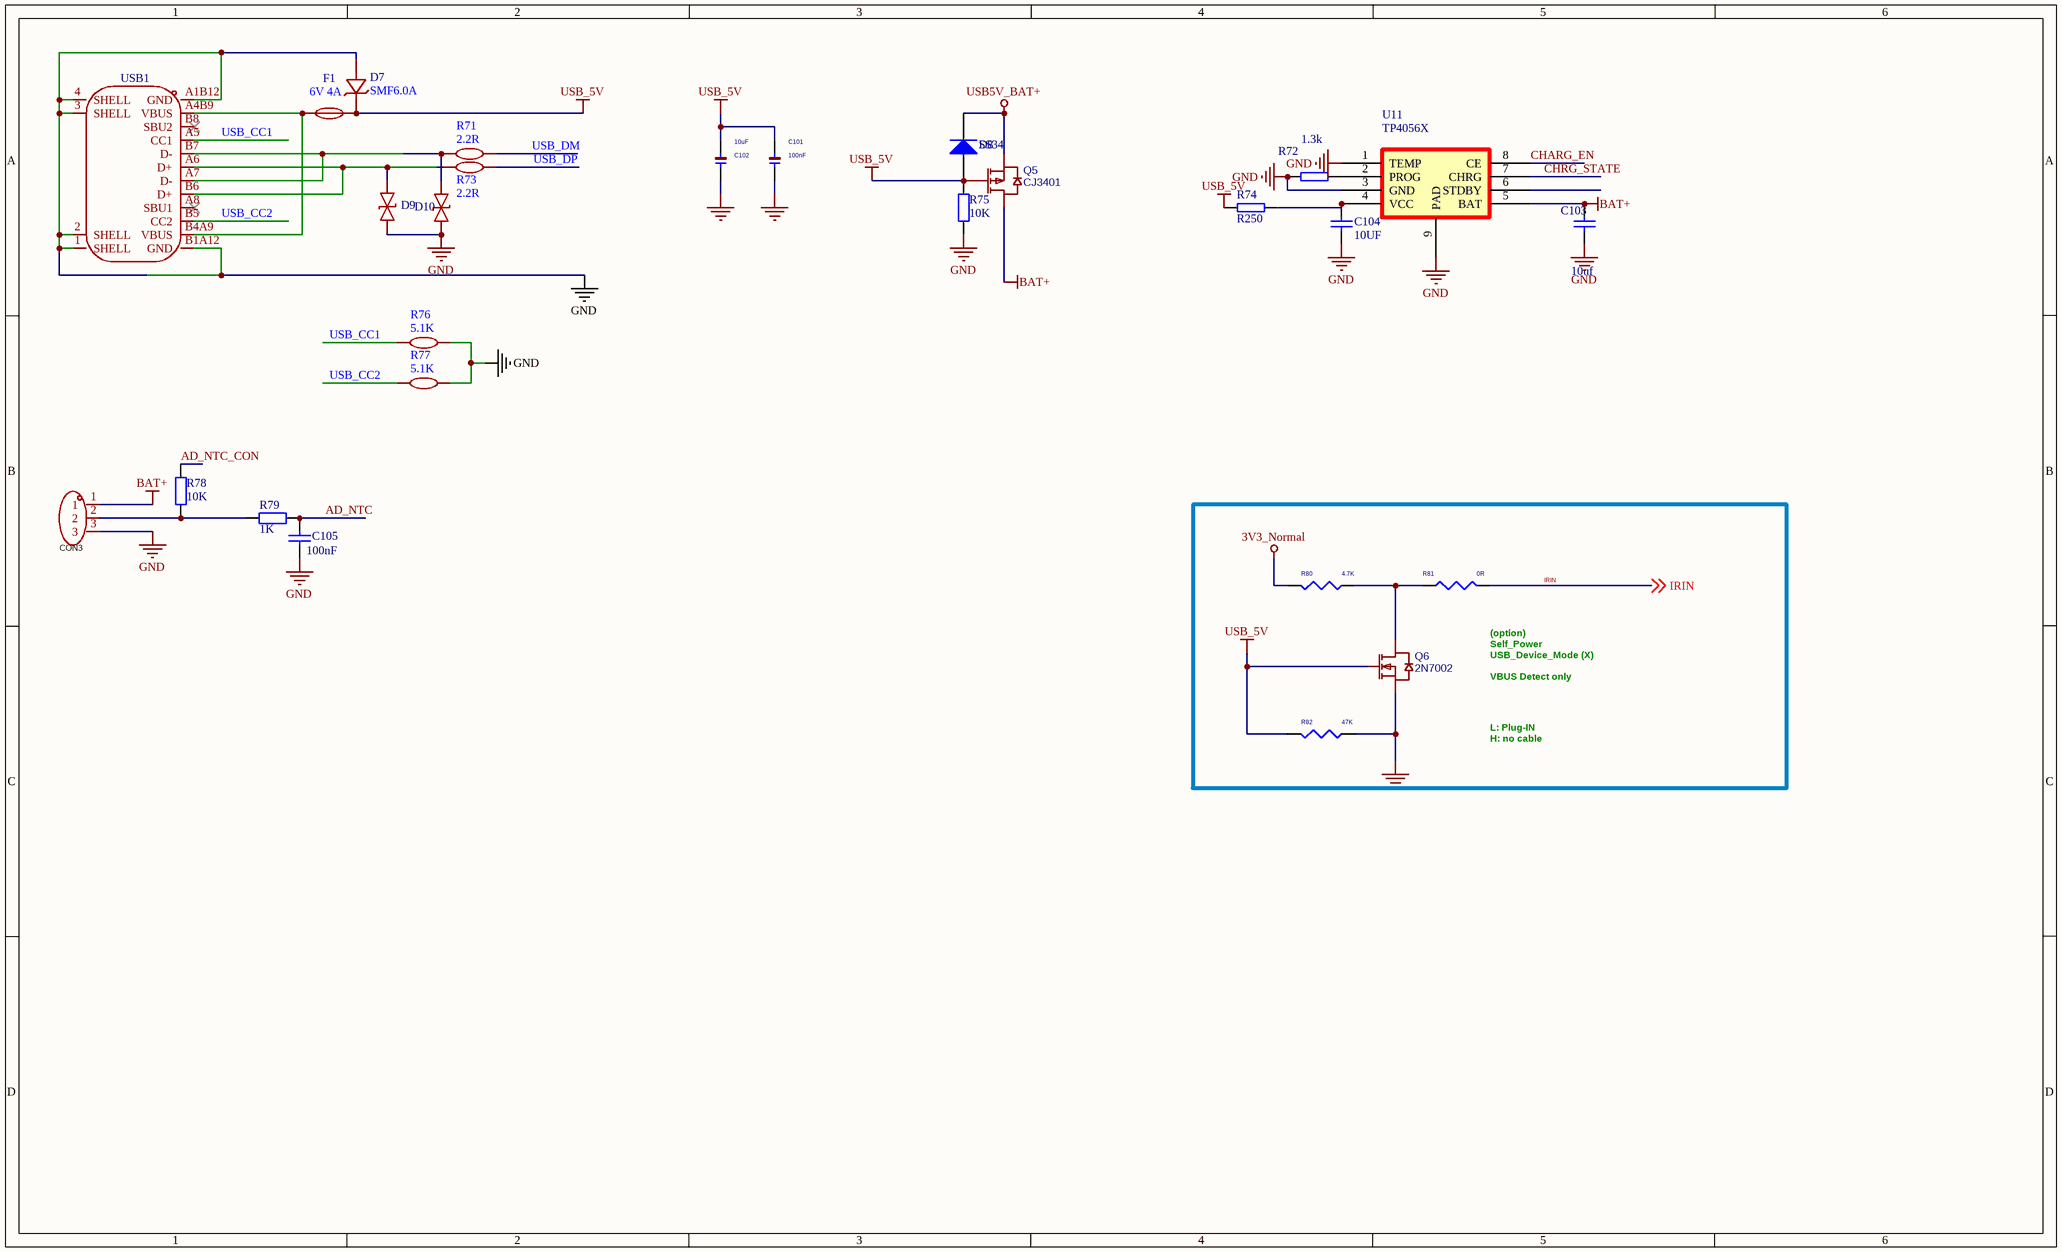
[diagram p4: USB_CHARGE.SchDoc]

### Parts
C101  100nF  [C0402]
C102  10uF  [C0402]
C103  10uf  [0603_C]
C104  10UF  [0603_c]
C105  100nF  [0603_C]
CON3  BX-PH2.0-3PZZ  [CONN-SMD_2.0-3PLT]  (value not drawn)
D7  SMF6.0A  [SOD-123]
D8  SS34  [SMA]
D9  LESD5Z5.0CT1G  [SOD-523_L1.2-W0.8-LS1.6-BI]  (value not drawn)
D10  LESD5Z5.0CT1G  [SOD-523_L1.2-W0.8-LS1.6-BI]  (value not drawn)
F1  6V 4A  [F1210]
Q5  CJ3401  [SOT-23]
Q6  2N7002  [SOT-23]
R71  2.2R  [R0603]
R72  1.3k  [0603_R]
R73  2.2R  [R0603]
R74  R250  [1206_R]
R75  10K  [0603_R]
R76  5.1K  [R0603]
R77  5.1K  [R0603]
R78  10K  [0603_R]
R79  1K  [0603_R]
R80  4.7K  [R0402]
R81  0R  [R0402]
R82  47K  [R0402]
U11  TP4056X  [SOP8-9]
USB1  HC-TYPE-C-16P-01A  [USB-C-SMD_HC-TYPE-C-16P-01A]  (value not drawn)

### Nets
3V3_Normal: R80.1
BAT+: C103.1 CON3.1 Q5.3(D) U11.5(BAT)
GND: C101.2 C102.2 C103.2 C104.1 C105.1 CON3.3 D7.2(A) D9.1 D10.1 Q6.2(S) R72.1 R75.1 R76.2 R77.2 R82.2 U11.1(TEMP) U11.3(GND) U11.9(PAD) USB1.1(SHELL) USB1.2(SHELL) USB1.3(SHELL) USB1.4(SHELL) USB1.A1B12(GND) USB1.B1A12(GND)  [project net DGND]
USB5V_BAT+: D8.2(K) Q5.2(S)
USB_5V: C101.1 C102.1 D7.1(K) D8.1(A) F1.2 Q5.1(G) Q6.1(G) R74.2 R75.2 R82.1
AD_NTC: C105.2 R79.2
AD_NTC_CON: R78.1
CHARG_EN: U11.8(CE)
CHRG_STATE: U11.7(CHRG)
IRIN: R81.1 ; off-sheet IRIN
USB_CC1: R76.1 USB1.A5(CC1)
USB_CC2: R77.1 USB1.B5(CC2)
USB_DM: R71.2
USB_DP: R73.2
NetC104_2: C104.2 R74.1 U11.4(VCC)
NetCON3_2: CON3.2 R78.2 R79.1
NetD9_2: D9.2 R73.1 USB1.A6(D+) USB1.B6(D+)
NetD10_2: D10.2 R71.1 USB1.A7(D-) USB1.B7(D-)
NetF1_1: F1.1 USB1.A4B9(VBUS) USB1.B4A9(VBUS)
NetQ6_3: Q6.3(D) R80.2 R81.2
NetR72_2: R72.2 U11.2(PROG)

Not connected (* = marked no-connect by the designer): U11 6(STDBY); USB1 A8(SBU1)* B8(SBU2)*

### Notes on the sheet
- (near R81) (option)
  Self_Power
  USB_Device_Mode (X)
  VBUS Detect only
- L: Plug-IN
  H: no cable

### Library data of the parts
C101 = C0402/100nF/10V/X7R: as C34 on sheet POWER; Creator: Alan.Liu#6135/0920796617
C102 = C0402: Class: DISCRETE
C103 = Cap: Capacitor; Value: 10nF; Published: 8-Jun-2000; Revision: July-2002: Re-released for DXP Platform.; Publisher: Altium Limited
C104 C105 = CAP
CON3 = BX-PH2.0-3PZZ: Add into BOM: yes; Pins Structure: 1x3P; Pitch: 2mm; Reference Series: PH; Number of PINs Per Row: 3; Current Rating (Max): 2A; Symbol: BX-PH2.0-3PZZ; Device: BX-PH2.0-3PZZ; LCSC Part Name: BX-PH2.0-3PZZ; Supplier Part: C18077745; Manufacturer Part: BX-PH2.0-3PZZ; JLCPCB Part Class: Extended Part; Datasheet: https://atta.szlcsc.com/upload/public/pdf/source/20231017/78B49E88B01779D5C268ECAB29020769.pdf; Supplier: LCSC; Convert to PCB: yes; Number of Pins: 3P; Number of Rows: 1; Row Spacing: -; Comment_1: BX-PH2.0-3PZZ
D7 = SMF6.0A_C19077499: Add into BOM: yes; Reverse Stand-Off Voltage (Vrwm): 6V; Maximum Clamping Voltage: 10.3V; Peak Pulse Current (Ipp)@10/1000us: 19.4A; Peak Pulse Power Dissipation (Ppp)@10/1000us: 200W; Breakdown Voltage: 6.67V; Reverse Leakage Current (Ir): 400uA; Type: TVS; Symbol: SMF6.0A_C19077499; Device: SMF6.0A_C19077499; Supplier: LCSC; Supplier Part: C19077499; Manufacturer Part: SMF6.0A; LCSC Part Name: SMF6.0A; Supplier Footprint: SOD-123FL; JLCPCB Part Class: Extended Part; Datasheet: https://atta.szlcsc.com/upload/public/pdf/source/20231201/BA209EB353689BD2A9785188AB9E10B0.pdf; Convert to PCB: yes
D8 = Diode 1N4148: High Conductance Fast Diode; Published: 8-Jun-2000; LatestRevisionDate: 17-Jul-2002; LatestRevisionNote: Re-released for DXP Platform.; DatasheetVersion: 1997; PackageReference: DO-35; Publisher: Altium Limited; PackageDescription: Diode, Axial; Body 3.8 x 1.9 mm (LxDia. max), Lead Dia. 0.53 mm (max); Code_JEDEC: DO-204-AH; ComponentLink1Description: Manufacturer Link; ComponentLink1URL: http://www.fairchildsemi.com/; ComponentLink2Description: Datasheet; ComponentLink2URL: http://www.fairchildsemi.com/ds/1N%2F1N4148.pdf
D9 D10 = LESD5Z5.0CT1G: as D4 on sheet Bluetooth; Symbol: LESD5Z5.0CT1G; Device: LESD5Z5.0CT1G; Supplier: LCSC; Manufacturer Part: LESD5Z5.0CT1G; Supplier Part: C136167; Supplier Footprint: SOD-523; Datasheet: https://atta.szlcsc.com/upload/public/pdf/source/20171026/C136167_15089841930291059137.pdf; Convert to PCB: yes
F1 = SMD1210B150TFT: Manufacturer Part: 6V   2A; Add into BOM: yes; Current Rating (Max): 100A; Hold Current: 1.5A; Trip Current: 3A; Power Dissipation: 800mW; Maximum Time to Trip: 300ms; Symbol: SMD1210B150TFT; Device: SMD1210B150TFT; Supplier Part: C269165; Supplier Footprint: 1210; Datasheet: https://atta.szlcsc.com/upload/public/pdf/source/20190124/C269169_A54EAE2455D8E3AD9881401F59298F09.pdf; Supplier: LCSC; Convert to PCB: yes; Operating Voltage (Max): 6V
Q5 = CJ3401: BOM_Manufacturer: CJ; BOM_Supplier: LCSC; BOM_Manufacturer Part: CJ3401; BOM_Supplier Part: C13799; BOM_JLCPCB Part Class: Extended Part; spicePre: Q; spiceSymbolName: CJ3401
Q6 = JMTL3400A: Contributor: LCSC; BOM_Supplier: LCSC; BOM_Supplier Part: C2890442; BOM_Manufacturer Part: JMTL3400A; BOM_JLCPCB Part Class: Extended Part; spicePre: Q; spiceSymbolName: JMTL3400A
R71 R73 R76 R77 = Res_0603: Convert to PCB: yes; Device: Res_0603; Add into BOM: yes; Supplier Footprint: 0603
  R71 R73: Value: 2.2R
  R76 R77: Value: 5.1K
R72 R74 = RES
R75 = Res2: Resistor; Value: 120R; Published: 8-Jun-2000; LatestRevisionDate: 17-Jul-2002; LatestRevisionNote: Re-released for DXP Platform.; PackageReference: AXIAL-0.4; Publisher: Altium Limited
R78 R79 = Res1: 贴片电阻
R80 R82 = R_Dup2
R81 = R_Dup1
U11 = TP4056
USB1 = HC-TYPE-C-16P-01A: Add into BOM: yes; Connector Type: Type-C; Number of Contacts: 16P; Number of Ports: 1; Current Rating - Power (Max): 5A; Symbol: HC-TYPE-C-16P-01A; Device: HC-TYPE-C-16P-01A; Supplier Part: C2894897; Manufacturer Part: HC-TYPE-C-16P-01A; Supplier Footprint: SMD; Datasheet: https://atta.szlcsc.com/upload/public/pdf/source/20221116/CF1C0058359F0761D6F7BB69303000BD.pdf; Supplier: LCSC; Convert to PCB: yes; Standard: -

## Nets that join several sheets
1V0: POWER (R40.2), QFN88_FLASH_UART (19 pins)
1V5_Normal: POWER (R29.2 R33.1), QFN88_FLASH_UART (10 pins)
3V3_CPU: POWER (C61.1 R47.2), QFN88_FLASH_UART (25 pins)
3V3_Normal: AUDIO (R1.1), POWER (10 pins), QFN88_FLASH_UART (C86.1 D6.2 R54.1), USB_CHARGE (R80.1)
BAT+: Bluetooth (Q2.2 R14.1), USB_CHARGE (C103.1 CON3.1 Q5.3 U11.5)
DGND: AUDIO (15 pins), Bluetooth (40 pins), POWER (38 pins), QFN88_FLASH_UART (51 pins), USB_CHARGE (24 pins)
USB5V_BAT+: AUDIO (L1.1), Bluetooth (8 pins), POWER (12 pins), USB_CHARGE (D8.2 Q5.2)
USB_5V: Bluetooth (Q1.1 R11.1), USB_CHARGE (10 pins)
AD_Bat_Con: Bluetooth (R16.2), QFN88_FLASH_UART (U8.74)
CHARG_EN: Bluetooth (U10.11), USB_CHARGE (U11.8)
CHRG_STATE: Bluetooth (U10.12), USB_CHARGE (U11.7)
IRIN: QFN88_FLASH_UART (U8.19), USB_CHARGE (R81.1)
LINEOUT_L: AUDIO (C11.1), QFN88_FLASH_UART (U8.5)
MICCM0: AUDIO (C6.2), QFN88_FLASH_UART (U8.2)
MICIN0: AUDIO (C4.2), QFN88_FLASH_UART (U8.1)
PM_GPIO4: POWER (Q4.1 R46.1 R48.1), QFN88_FLASH_UART (U8.23)
POWER_EN: Bluetooth (U10.24), POWER (R38.2)
RX_SOC: Bluetooth (U10.22), QFN88_FLASH_UART (U8.42)
SPK_SHDN: AUDIO (C8.1 R4.1 U1.1), QFN88_FLASH_UART (U8.75)
TX_SOC: Bluetooth (U10.23), QFN88_FLASH_UART (U8.43)
USB_DM: QFN88_FLASH_UART (U8.84), USB_CHARGE (R71.2)
USB_DP: QFN88_FLASH_UART (U8.85), USB_CHARGE (R73.2)